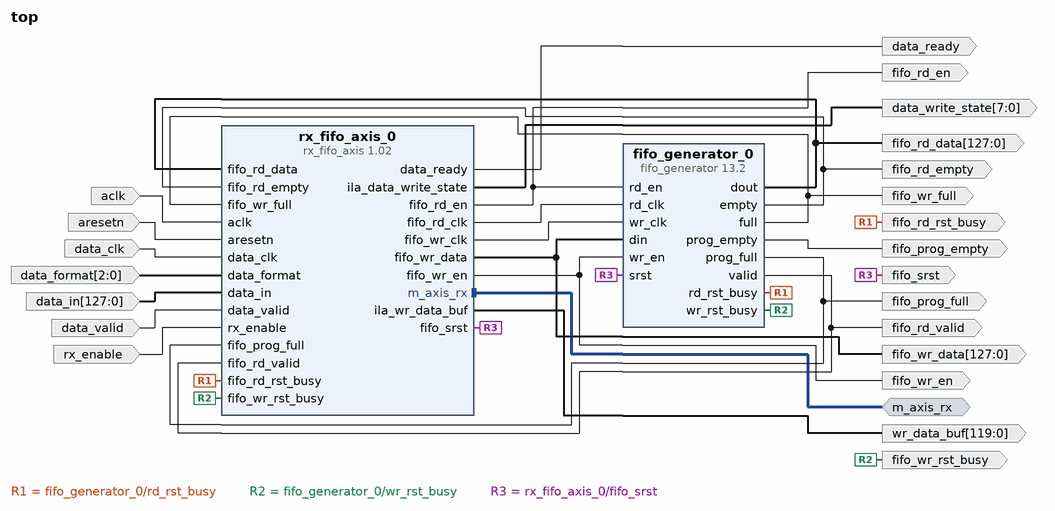
[diagram p0: block diagram of the top level]
# Vivado block design top, xczu3cg-sfvc784-1-e, Vivado 2021.1.1
create_bd_design top

create_bd_intf_port -mode Master -vlnv xilinx.com:interface:axis_rtl:1.0 m_axis_rx
set_property -dict {CONFIG.FREQ_HZ 200000000} [get_bd_intf_ports m_axis_rx]
create_bd_port -dir O fifo_rd_valid
create_bd_port -dir O fifo_prog_full
create_bd_port -dir O fifo_wr_rst_busy
create_bd_port -dir O fifo_rd_rst_busy
create_bd_port -dir O -from 119 -to 0 wr_data_buf
create_bd_port -dir O -from 7 -to 0 data_write_state
create_bd_port -dir O data_ready
create_bd_port -dir I -type rst aresetn
create_bd_port -dir I -type clk aclk
set_property -dict {CONFIG.FREQ_HZ 200000000} [get_bd_ports aclk]
create_bd_port -dir I rx_enable
create_bd_port -dir I -from 2 -to 0 data_format
create_bd_port -dir I -type clk data_clk
set_property -dict {CONFIG.FREQ_HZ 250000000} [get_bd_ports data_clk]
create_bd_port -dir I data_valid
create_bd_port -dir I -from 127 -to 0 data_in
create_bd_port -dir O -from 127 -to 0 fifo_rd_data
create_bd_port -dir O fifo_rd_en
create_bd_port -dir O fifo_rd_empty
create_bd_port -dir O fifo_wr_full
create_bd_port -dir O -from 127 -to 0 fifo_wr_data
create_bd_port -dir O fifo_wr_en
create_bd_port -dir O fifo_srst
create_bd_port -dir O fifo_prog_empty

create_bd_cell -type ip -vlnv xilinx.com:ip:fifo_generator:13.2 fifo_generator_0
set_property -dict [list \
  CONFIG.Empty_Threshold_Assert_Value 256 \
  CONFIG.Fifo_Implementation Independent_Clocks_Builtin_FIFO \
  CONFIG.Full_Threshold_Assert_Value 523 \
  CONFIG.Input_Data_Width 128 \
  CONFIG.Programmable_Empty_Type Single_Programmable_Empty_Threshold_Constant \
  CONFIG.Programmable_Full_Type Single_Programmable_Full_Threshold_Constant \
  CONFIG.Read_Clock_Frequency 200 \
  CONFIG.Valid_Flag true \
  CONFIG.Write_Clock_Frequency 250 \
] [get_bd_cells fifo_generator_0]
create_bd_cell -type ip -vlnv merckgroup.com:user:rx_fifo_axis:1.02 rx_fifo_axis_0

# ---- connections ----

connect_bd_intf_net [get_bd_intf_ports m_axis_rx] [get_bd_intf_pins rx_fifo_axis_0/m_axis_rx]
connect_bd_net [get_bd_ports aclk] [get_bd_pins rx_fifo_axis_0/aclk]
connect_bd_net [get_bd_ports aresetn] [get_bd_pins rx_fifo_axis_0/aresetn]
connect_bd_net [get_bd_ports data_clk] [get_bd_pins rx_fifo_axis_0/data_clk]
connect_bd_net [get_bd_ports data_format] [get_bd_pins rx_fifo_axis_0/data_format]
connect_bd_net [get_bd_ports data_in] [get_bd_pins rx_fifo_axis_0/data_in]
connect_bd_net [get_bd_ports data_valid] [get_bd_pins rx_fifo_axis_0/data_valid]
connect_bd_net [get_bd_pins fifo_generator_0/dout] [get_bd_ports fifo_rd_data] [get_bd_pins rx_fifo_axis_0/fifo_rd_data]
connect_bd_net [get_bd_pins fifo_generator_0/empty] [get_bd_ports fifo_rd_empty] [get_bd_pins rx_fifo_axis_0/fifo_rd_empty]
connect_bd_net [get_bd_pins fifo_generator_0/full] [get_bd_ports fifo_wr_full] [get_bd_pins rx_fifo_axis_0/fifo_wr_full]
connect_bd_net [get_bd_pins fifo_generator_0/prog_empty] [get_bd_ports fifo_prog_empty]
connect_bd_net [get_bd_pins fifo_generator_0/prog_full] [get_bd_ports fifo_prog_full] [get_bd_pins rx_fifo_axis_0/fifo_prog_full]
connect_bd_net [get_bd_pins fifo_generator_0/rd_rst_busy] [get_bd_ports fifo_rd_rst_busy] [get_bd_pins rx_fifo_axis_0/fifo_rd_rst_busy]
connect_bd_net [get_bd_pins fifo_generator_0/valid] [get_bd_ports fifo_rd_valid] [get_bd_pins rx_fifo_axis_0/fifo_rd_valid]
connect_bd_net [get_bd_pins fifo_generator_0/wr_rst_busy] [get_bd_ports fifo_wr_rst_busy] [get_bd_pins rx_fifo_axis_0/fifo_wr_rst_busy]
connect_bd_net [get_bd_ports rx_enable] [get_bd_pins rx_fifo_axis_0/rx_enable]
connect_bd_net [get_bd_pins rx_fifo_axis_0/data_ready] [get_bd_ports data_ready]
connect_bd_net -net rx_fifo_axis_0_data_write_state [get_bd_pins rx_fifo_axis_0/ila_data_write_state] [get_bd_ports data_write_state]
connect_bd_net [get_bd_pins rx_fifo_axis_0/fifo_rd_clk] [get_bd_pins fifo_generator_0/rd_clk]
connect_bd_net [get_bd_pins rx_fifo_axis_0/fifo_rd_en] [get_bd_pins fifo_generator_0/rd_en] [get_bd_ports fifo_rd_en]
connect_bd_net [get_bd_pins rx_fifo_axis_0/fifo_srst] [get_bd_pins fifo_generator_0/srst] [get_bd_ports fifo_srst]
connect_bd_net [get_bd_pins rx_fifo_axis_0/fifo_wr_clk] [get_bd_pins fifo_generator_0/wr_clk]
connect_bd_net [get_bd_pins rx_fifo_axis_0/fifo_wr_data] [get_bd_pins fifo_generator_0/din] [get_bd_ports fifo_wr_data]
connect_bd_net [get_bd_pins rx_fifo_axis_0/fifo_wr_en] [get_bd_pins fifo_generator_0/wr_en] [get_bd_ports fifo_wr_en]
connect_bd_net -net rx_fifo_axis_0_wr_data_buf [get_bd_pins rx_fifo_axis_0/ila_wr_data_buf] [get_bd_ports wr_data_buf]

validate_bd_design
save_bd_design
